# Altium schematic sheet LCL_CAN.SchDoc
size A3; Organization: Altium Limited; Address1: L3, 12a Rodborough Rd; Address2: Frenchs Forest; Address3: NSW; Address4: Australia 2086
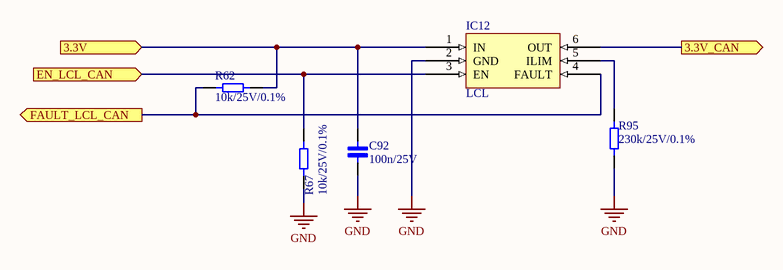
[diagram p0: LCL_CAN.SchDoc]

## Parts
C92  100n/25V  [Cap_0402]
IC12  LCL  [SOT-23-6]
R62  10k/25V/0.1%  [RES_0402]
R67  10k/25V/0.1%  [RES_0402]
R95  230k/25V/0.1%  [RES_0402]

## Ports
3.3V (in), 3.3V_CAN (out), EN_LCL_CAN (in), FAULT_LCL_CAN (out)

## Nets
GND: C92.1 IC12.2(GND) R67.1 R95.1
3.3V: C92.2 IC12.1(IN) R62.2 ; port 3.3V
3.3V_CAN: IC12.6(OUT) ; port 3.3V_CAN
EN_LCL_CAN: IC12.3(EN) R67.2 ; port EN_LCL_CAN
FAULT_LCL_CAN: IC12.4(FAULT) R62.1 ; port FAULT_LCL_CAN
NetIC12_5: IC12.5(ILIM) R95.2

## Notes on the sheet
- Title
- Size:
- Date:
- A3
- Number:
- Time:
- Revision:
- Sheet
- of
- File:

## Library data of the parts
C92 = Cap_0402_100n: Ceramic Capacitor 100n / 0402 / 25V / ±5%, Wurth Elektronik MLCC; ComponentLink1Description: New link; ComponentLink1URL: https://www.we-online.com/catalog/en/WCAP-CSGP-25VDC
IC12 = TPS2553: Latch-off Current Limiter; ComponentLink1Description: New link; ComponentLink1URL: https://www.ti.com/lit/ds/symlink/tps2553.pdf?ts=1603819295065&ref_url=https%253A%252F%252Fwww.google.com%252F
R62 R67 = Res_0402_10k: Vishay, thin film resistor 10k/25V/0.1%
R95 = Res_0402_230k: Vishay, thin film resistor 230k/25V/0.1%